# Altium schematic sheet SDP21_Daughter_Board_Schematic.SchDoc
size A4
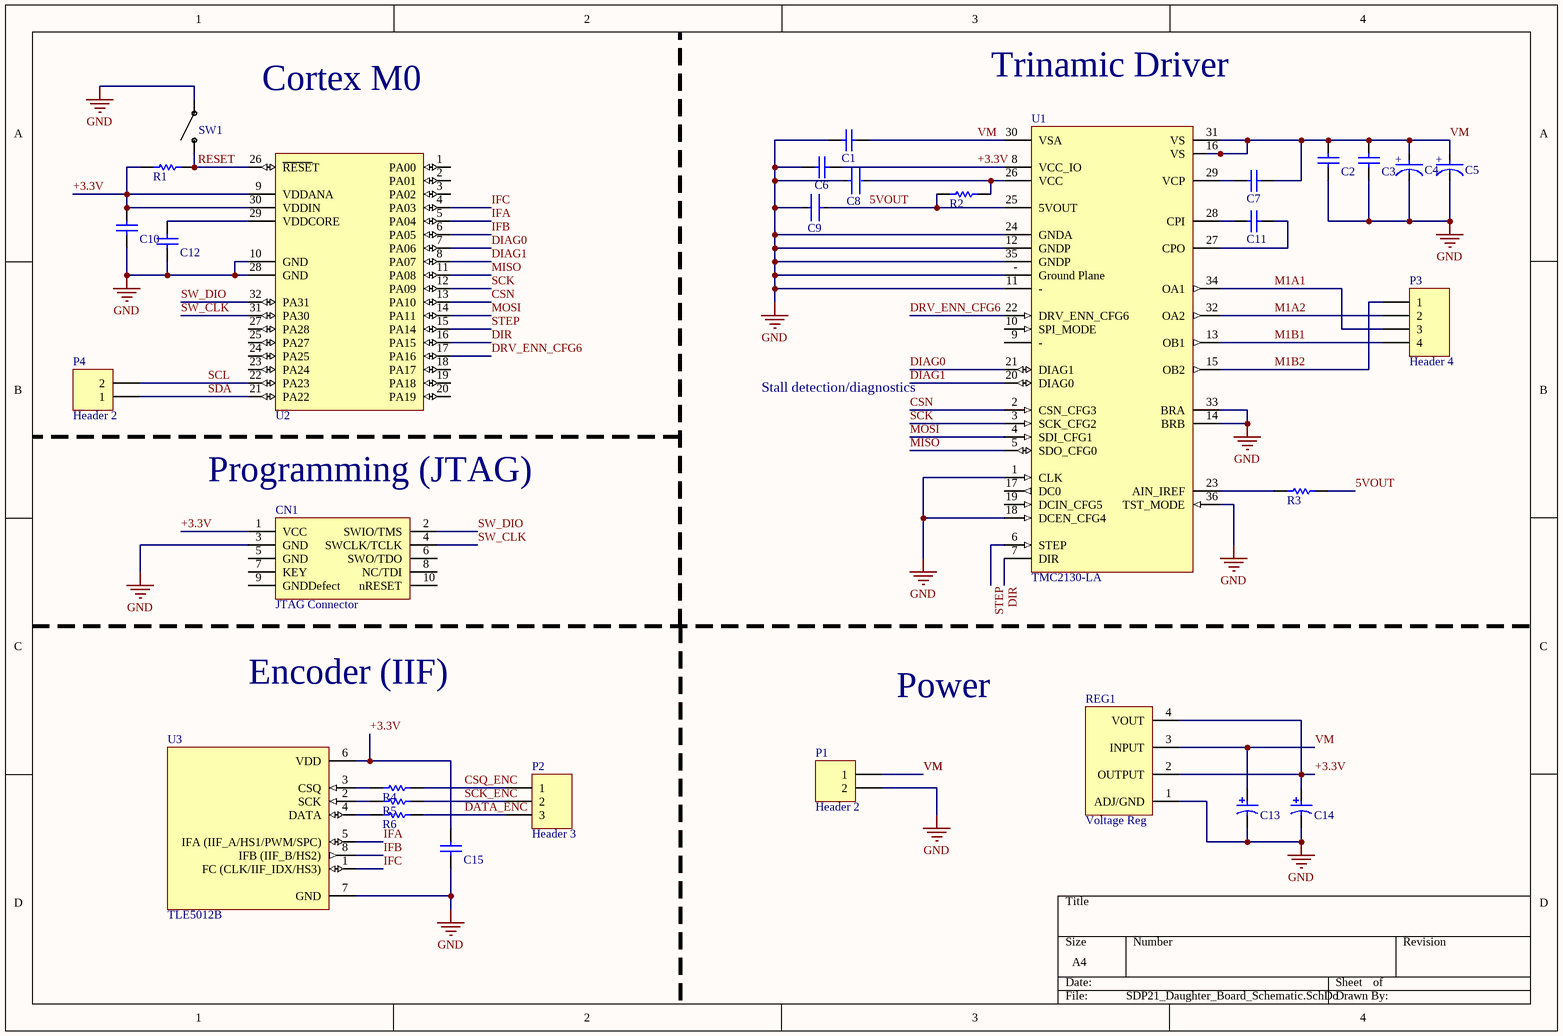
[diagram p0: SDP21_Daughter_Board_Schematic.SchDoc]

## Parts
C1  CGA3E2X7R1H104K080AA  [CAPC1608X90X20LL10]  (value not drawn)
C2  CGA3E2X7R1H104K080AA  [CAPC1608X90X20LL10]  (value not drawn)
C3  C1210C476M4PACTU  [CAPC3225X270X50LL20T25]  (value not drawn)
C4  EEE-FK1H101P  [FP-EEE-FK1H101P-MFG]  (value not drawn)
C5  EEE-FK1H101P  [FP-EEE-FK1H101P-MFG]  (value not drawn)
C6  CGA3E2X7R1H104K080AA  [CAPC1608X90X20LL10]  (value not drawn)
C7  CGA3E2X7R1H104K080AA  [CAPC1608X90X20LL10]  (value not drawn)
C8  C0603C474K4RACTU  [FP-C0603C-CF-MFG]  (value not drawn)
C9  C0603C475K9PACTU  [FP-C0603-CG-MFG]  (value not drawn)
C10  GRM188R60J106ME47D  [CAPC1608X90X35NL10T15]  (value not drawn)
C11  CC0603KRX7R9BB223  [CAPC1608X90X40ML10T20]  (value not drawn)
C12  GRM188R60J106ME47D  [CAPC1608X90X35NL10T15]  (value not drawn)
C13  T491A106K010AT  [KEMT-A-3216-18-2_M]  (value not drawn)
C14  TAJA226K010RNJ  [AVX-TAJ-A-2_L]  (value not drawn)
C15  CGA3E2X7R1H104K080AA  [CAPC1608X90X20LL10]  (value not drawn)
CN1  JTAG Connector  [Header 5x2 - 50mil]
P1  Header 2  [HDR1X2]
P2  Header 3  [HDR1X3]
P3  Header 4  [HDR1X4]
P4  Header 2  [HDR1X2]
R1  ERJ3EKF1002V  [RESC1609X55X30LL15T15]  (value not drawn)
R2  CRCW06033R30JNEA  [RESC1609X50X30ML10T20]  (value not drawn)
R3  ERJ3EKF1002V  [RESC1609X55X30LL15T15]  (value not drawn)
R4  470R 1% 0603(1608)  [RESC0603(1608)_M]  (value not drawn)
R5  470R 1% 0603(1608)  [RESC0603(1608)_M]  (value not drawn)
R6  470R 1% 0603(1608)  [RESC0603(1608)_M]  (value not drawn)
REG1  Voltage Reg  [SOT223]
SW1  PTS525SM15SMTR2 LFS  [PTS525 SM08 SMTR2 LFS]  (value not drawn)
U1  TMC2130-LA  [QFN-36]
U2  ATSAMD21E15B-AUT  [TQFP-32]  (value not drawn)
U3  TLE5012B  [PG-DSO-8]

## Nets
GND: C1.1 C2.1 C3.1 C4.1(C) C5.1(C) C6.1 C8.1 C9.2 C10.1 C12.1 C13.2 C14.2 C15.1 CN1.3(GND) P1.2 REG1.1(ADJ/GND) SW1.2 U1.1(CLK) U1.11(-) U1.12(GNDP) U1.14(BRB) U1.18(DCEN_CFG4) U1.24(GNDA) U1.33(BRA) U1.35(GNDP) U1.36(TST_MODE) U1.-(Ground_Plane) U2.10(GND) U2.28(GND) U3.7(GND)
5VOUT: C9.1 R2.1 R3.2 U1.25(5VOUT)
+3.3V: C6.2 C10.2 C14.1 C15.2 CN1.1(VCC) R1.1 REG1.2(OUTPUT) REG1.4(VOUT) U1.8(VCC_IO) U2.9(VDDANA) U2.30(VDDIN) U3.6(VDD)
CSN: U1.2(CSN_CFG3) U2.13(PA10)
CSQ_ENC: P2.1 R4.2
DATA_ENC: P2.3 R6.2
DIAG0: U1.21(DIAG1) U2.7(PA06)
DIAG1: U1.20(DIAG0) U2.8(PA07)
DIR: U1.7(DIR) U2.16(PA15)
DRV_ENN_CFG6: U1.22(DRV_ENN_CFG6) U2.17(PA16)
IFA: U2.5(PA04) U3.5(IFA_(IIF_A/HS1/PWM/SPC))
IFB: U2.6(PA05) U3.8(IFB_(IIF_B/HS2))
IFC: U2.4(PA03) U3.1(FC_(CLK/IIF_IDX/HS3))
M1A1: P3.3 U1.34(OA1)
M1A2: P3.2 U1.32(OA2)
M1B1: P3.4 U1.13(OB1)
M1B2: P3.1 U1.15(OB2)
MISO: U1.5(SDO_CFG0) U2.11(PA08)
MOSI: U1.4(SDI_CFG1) U2.14(PA11)
RESET: R1.2 SW1.1 U2.26(~{RESE}T)
SCK: U1.3(SCK_CFG2) U2.12(PA09)
SCK_ENC: P2.2 R5.2
SCL: P4.2 U2.22(PA23)
SDA: P4.1 U2.21(PA22)
STEP: U1.6(STEP) U2.15(PA14)
SW_CLK: CN1.4(SWCLK/TCLK) U2.31(PA30)
SW_DIO: CN1.2(SWIO/TMS) U2.32(PA31)
VM: C1.2 C2.2 C3.2 C4.2(A) C5.2(A) C7.1 C13.1 P1.1 REG1.3(INPUT) U1.16(VS) U1.30(VSA) U1.31(VS)
NetC7_2: C7.2 U1.29(VCP)
NetC8_2: C8.2 R2.2 U1.26(VCC)
NetC11_1: C11.1 U1.28(CPI)
NetC11_2: C11.2 U1.27(CPO)
NetC12_2: C12.2 U2.29(VDDCORE)
NetR3_1: R3.1 U1.23(AIN_IREF)
NetR4_1: R4.1 U3.3(CSQ)
NetR5_1: R5.1 U3.2(SCK)
NetR6_1: R6.1 U3.4(DATA)

Not connected (* = marked no-connect by the designer): CN1 5(GND) 6(SWO/TDO) 7(KEY) 8(NC/TDI) 9(GNDDefect) 10(nRESET); U1 9(-) 10(SPI_MODE) 17(DC0) 19(DCIN_CFG5); U2 1(PA00) 2(PA01) 3(PA02) 18(PA17) 19(PA18) 20(PA19) 23(PA24) 24(PA25) 25(PA27) 27(PA28)

## Notes on the sheet
- Cortex M0
- Trinamic Driver
- Stall detection/diagnostics
- Programming (JTAG)
- Encoder (IIF)
- Power
- (in symbol CMP-05427-000005-1) +

## Library data of the parts
C1 C2 C6 C7 C15 = CMP-2000-07546-1: Chip Capacitor, 0.1 uF, +/- 10%, 50 V, -55 to 125 degC, 0603 (1608 Metric), RoHS, Tape and Reel; Manufacturer: TDK; Capacitance: 100nF; Voltage: 50V; Dielectric: X7R; Package Reference: 603; Radiation Hardening: No; Composition: Ceramic; Datasheet URL: https://product.tdk.com/info/en/catalog/datasheets/mlcc_automotive_general_en.pdf; Mounting Technology: SurfaceMount; Datasheet Version: 12/2014; Width: 0.8mm; Length: 1.6mm; Tolerance: 10%; Case Code (Imperial): 0603; RoHSCompliant: True; Min Operating Temperature: -55degC; Package Description: 2-Pin Surface Mount Device, Body 1.6 x 0.8 mm; Packaging: TapeandReel; Package Quantity: 1; Voltage Rating: 50V; Mount: SurfaceMount; Lead Free: LeadFree; Depth: 0.8mm; Termination: SMD/SMT; Case Code (Metric): 1608; Thickness: 0.035inch; Height: 0.8mm; Weight: 7.1E-05oz; Voltage Rating (DC): 50V; REACH SVHC: NoSVHC; Manufacturer URL: http://www.tdk.com/; Case/Package: 0603; Max Operating Temperature: 125degC
C3 = CMP-2000-06020-1: Chip Capacitor, 47 uF, +/- 20%, 16 V, -55 to 85 degC, 1210 (3225 Metric), RoHS, Tape and Reel; Manufacturer: Kemet; Capacitance: 47µF; Catalog Drawings: ACTU_1210; Product Training Modules: CapacitorBasics-TypicalUsesforCapacitors; Temperature Coefficient: X5R; Other Names: 399-5514-6; Online Catalog: X5RDielectric(CommercialGrade); Voltage - Rated: 16V; Manufacturer URL: http://www.kemet.com/; Applications: GeneralPurpose; Lead Style: -; Package / Case: 1210(3225Metric); Mounting Type: SurfaceMount,MLCC; Features: -; Ratings: -; Thickness (Max): 0.110"(2.80mm); Package Description: 2-Pin Surface Mount Device, Body 3.2 x 2.5 mm; Tolerance: ±20%; Datasheet URL: http://www.datasheets360.com/pdf/-8690541728068054270; Packaging: Digi-Reel®; Height - Seated (Max): -; Mounting Technology: SurfaceMount; Operating Temperature: -55°C~85°C; Standard Package: 1; Lead Spacing: -; Family: CeramicCapacitors; Size / Dimension: 0.126"Lx0.098"W(3.20mmx2.50mm); Series: C; Category: Capacitors; Package Reference: 1210; Datasheet Version: 05/2013
C4 C5 = CMP-05427-000005-1: CAP ALUM 100UF 20% 50V SMD; Manufacturer: Panasonic Electronic Components; Automotive Grade: Grade 2; Dissipation Factor: 10%; Life: 2000Hours; Ripple Current: 350mA; Material: Aluminum; Esr: 0.34Ω; Leakage Current: 50uA; Tolerance: 20%; Package: 0; ComponentLink2URL: https://industrial.panasonic.com/cdbs/www-data/pdf/RDE0000/ABA0000C1181.pdf; Manufacturer Part Number: EEE-FK1H101P; Temperature Range Low: -55°C; Voltage Rating: 50V; ComponentLink2Description: Datasheet; Category: Cap; Digikey Description: CAP ALUM 100UF 20% 50V SMD; Octopart: https://octopart.com/eeefk1h101p-panasonic-4642841; Automotive: Yes; Temperature: -55°C to +105°C; Capacitance: 100uF; Lead Free: Yes; Mouser Description: Cap Aluminum Lytic 100uF 50V 20% (8 X 10.2mm) SMD 350mA 2000h 105C Automotive T/R; Height: 10.5mm; Device Class L3: Aluminum Electrolytic Capacitors; Value: 100uF; Device Class L1: Passive Components; RoHS: TRUE; Device Class L2: Capacitors; Temperature Range High: +105°C
C8 = CMP-03020-024061-1: CAP CER 0.47UF 16V X7R 0603; Manufacturer: KEMET; Automotive Grade: Grade 1; Value: 0.47 μF; Tolerance: 0.1; Temperature Coefficient: 30ppm/°C; Material: Ceramic; Device Class L3: Ceramic Capacitors; ComponentLink2URL: https://api.kemet.com/component-edge/download/datasheet/C0603C100J5GACAUTO.pdf; Height: 0.87mm; ComponentLink2Description: Datasheet; Device Class L2: Capacitors; Temperature Range Low: -55°C; Temperature Range High: +125°C; RoHS: TRUE; Mouser Description: 0603 C 470nF Ceramic Multilayer Capacitor, 16 V, +125degC, X7R Dielec, +/-10%; Temperature Characteristic: X7R; Manufacturer Part Number: C0603C474K4RACTU; Digikey Description: CAP CER 0.47UF 16V X7R 0603; Lead Free: Yes; Automotive: Yes; Octopart: https://octopart.com/c0603c474k4ractu-kemet-109683; Capacitance: 0.47 μF; Package: C0603C-CF; Voltage Rating: 16 V; Device Class L1: Passive Components; Category: Cap; Temperature: -55°C to +125°C
C9 = CMP-03020-024641-1: CAP CER 4.7UF 6.3V X5R 0603; Manufacturer: Kemet; Temperature Coefficient: 15%; Tolerance: 10%; Material: Ceramic; Device Class L3: Ceramic Capacitors; RoHS: TRUE; Value: 4.7uF; Lead Free: Yes; ComponentLink2Description: Datasheet; Mouser Description: Multilayer Ceramic Capacitors MLCC - SMD/SMT 6.3volts 4.7uF X5R 10%; Package: C0603-CG; Digikey Description: CAP CER 4.7UF 6.3V X5R 0603; ComponentLink2URL: https://content.kemet.com/datasheets/KEM_C1006_X5R_SMD.pdf; Category: Cap; Temperature Range Low: -55°C; Capacitance: 4.7uF; Temperature: -55°C to +85°C; Octopart: https://octopart.com/c0603c475k9pactu-kemet-104242; Ipc Land Pattern Name: CAPC16080X80; Voltage Rating: 6.3V; Temperature Range High: +85°C; Height: 0.9mm; Temperature Characteristic: X5R; Device Class L1: Passive Components; Manufacturer Part Number: C0603C475K9PACTU; Automotive: No; Device Class L2: Capacitors
C10 C12 = CMP-2006-02792-1: Manufacturer: Murata; Part Number: GRM188R60J106ME47D
C11 = CMP-2100-03602-1: Chip Capacitor, 22 nF, +/- 10%, 50 V, -55 to 125 degC, 0603 (1608 Metric), RoHS, Tape and Reel; Manufacturer: Yageo; Voltage Rating (DC): 50V; Insulation Resistance: 100GR; Dielectric: X7R; Dielectric Material: Ceramic; Capacitance: 22nF; REACH SVHC: NoSVHC; Datasheet Version: Rev. 15, 10/2016; Case Code (Imperial): 0603; Manufacturer URL: http://www.yageo.com/; Lead Free: LeadFree; Package Description: 2-Pin Surface Mount Device, Body 1.6 x 0.8 mm; Packaging: TapeandReel; RoHSCompliant: True; Depth: 0.8mm; Package Reference: 0603; Tolerance: 10%; Width: 0.031inch; Package Quantity: 1; Number of Pins: 2; Voltage Rating: 50V; Datasheet URL: http://www.yageo.com/documents/recent/UPY-GPHC_X7R_6.3V-to-50V_15.pdf; Min Operating Temperature: -55degC; Max Operating Temperature: 125degC; Height: 0.8mm; Thickness: 0.035inch; Case Code (Metric): 1608; Radiation Hardening: No; Termination: SMD/SMT; Composition: Ceramic; Length: 1.6mm; Case/Package: 0603; Mount: SurfaceMount
C13 = CMP-2000-05172-1: Capacitor, Tantalum, 10 uF, +/- 10%, 10 V, -55 to 125 degC, 2-Pin SMD (1206), RoHS, Tape and Reel; Manufacturer Size Code: A; Manufacturer: Kemet; Type: Molded; Online Catalog: T491Series; Other Names: 399-3684-2; Voltage - Rated: 10V; Lifetime @ Temp.: 2000Hrs@85degC; Product Training Modules: CapacitorBasics-TypicalUsesforCapacitorsDeratingGuidelinesforSurfaceMountTantalumCapacitors; ESR (Equivalent Series Resistance): 3.8Ohm; Capacitance: 10µF; Catalog Drawings: T49x,T5xxSeries_A-side1T49x,T5xxSeries_A,B-side2T49x,T5xxSeries_A,SBottom; Family: TantalumCapacitors; Manufacturer URL: http://www.kemet.com/; Datasheet URL: http://www.farnell.com/datasheets/1824869.pdf; Package Reference: 1206; Packaging: Tape&Reel(TR); Series: T491; Operating Temperature: -55degC~125degC; Mounting Type: SurfaceMount; Height - Seated (Max): 0.071"(1.80mm); Package / Case: 1206(3216Metric); Package Description: 2-Pin Surface Mount Device, Body 3.2 x 1.6 mm; Features: GeneralPurpose; Tolerance: ±10%; Lead Spacing: -; Size / Dimension: 0.126"Lx0.063"W(3.20mmx1.60mm); Standard Package: 2,000; Datasheet Version: Apr-14; Category: Capacitors
C14 = CMP-2000-07524-1: Chip Capacitor, 22 uF, +/- 10%, 10 V, -55 to 125 degC, 1206 (3216 Metric), RoHS, Tape and Reel; Manufacturer: AVX; Leakage Current: 2.2uA; Polarity: Polar; Dielectric Material: Tantalum; Voltage Rating (DC): 10V; Dissipation Factor: 8%; ESR (Equivalent Series Resistance): 3Ohm; Capacitance: 22uF; Height - Seated (Max): 0.071inch; Number of Pins: 2; Termination: SMD/SMT; Package Quantity: 1; Datasheet Version: 09/2017; Packaging: TapeandReel; Case/Package: 1206; Lead Free: LeadFree; Manufacturer URL: http://www.avx.com/; RoHSCompliant: True; Mount: PCB; Package Reference: TAJ-A-2; Width: 1.6mm; Height: 1.6mm; Radiation Hardening: No; Lead Pitch: 1.1mm; Tolerance: 10%; REACH SVHC: NoSVHC; Depth: 1.6mm; Package Description: 2-Pin Surface Mount Device, Body 3.2 x 1.65 mm; Case Code (Metric): 3216; Case Code (Imperial): 1206; Mounting Technology: SurfaceMount; Datasheet URL: http://datasheets.avx.com/TAJ.pdf; Voltage: 10V; Length: 3.2mm; Max Operating Temperature: 125degC; Voltage Rating: 10V; Min Operating Temperature: -55degC
P1 P4 = Header 2: Header, 2-Pin; LatestRevisionDate: 17-Jul-2002; LatestRevisionNote: Re-released for DXP Platform.; Publisher: Altium Limited
P2 = Header 3: Header, 3-Pin; LatestRevisionDate: 17-Jul-2002; LatestRevisionNote: Re-released for DXP Platform.; Publisher: Altium Limited
P3 = Header 4: Header, 4-Pin; LatestRevisionDate: 17-Jul-2002; LatestRevisionNote: Re-released for DXP Platform.; Publisher: Altium Limited
R1 R3 = CMP-2000-07452-1: Chip Resistor, 10 KOhm, +/- 1%, 0.1 W, -55 to 155 degC, 0603 (1608 Metric), RoHS, Tape and Reel; Manufacturer: Panasonic; Voltage Rating: 75V; Case\/Package: 0603; Power Rating: 100mW; Resistance: 10KOhm; Temperature Coefficient: 100ppm\/degreesC; Number of Pins: 2; Package Reference: 603; Depth: 0.8mm; Mount: SurfaceMount; Package Description: 2-Pin Surface Mount Device, Body 1.6 x 0.85 mm; Datasheet Version: 02/2017; Length: 1.6mm; Lead Free: LeadFree; Height: 0.45mm; Number of Terminations: 2; Max Power Dissipation: 100mW; Min Operating Temperature: -55degC; Datasheet URL: https://industrial.panasonic.com/cdbs/www-data/pdf/RDA0000/AOA0000C304.pdf; Termination: SMD/SMT; Case Code (Metric): 1608; Case Code (Imperial): 0603; Tolerance: 1%; Max Operating Temperature: 155degC; RoHSCompliant: true; Voltage Rating (DC): 75V; Radiation Hardening: No; Packaging: TapeandReel; Composition: ThickFilm; Mounting Technology: SurfaceMount; Manufacturer URL: http://www.panasonic.com/; Width: 0.031inch; REACH SVHC: NoSVHC; Contact Plating: Tin; Military Standard: Not; Package Quantity: 1
R2 = CMP-2000-03328-1: Manufacturer: Vishay Dale; Part Number: CRCW06033R30JNEA
R4-R6 = CMP-1012-00473-1: 470R 0.1W 1% 0603 (1608 Metric)  SMD; Value: 470.00 Ohm; Case-Metric: 1608; Case-EIA: 0603; Power: 0.1 W; Technology: SMT; Tolerance: 1 %
SW1 = Tactile Push Button: SWITCH TACTILE SPST-NO 0.02A 15V
U1 = TMC2130-LA: TMC2130-LA Trinamic Driver QFN-36
U2 = ATSAMD21E15B-AUT: IC MCU 32BIT 32KB FLASH 32TQFP
U3 = TLE5012B: TLE5012B GMR-Based Angle Sensor PG-DSO-8